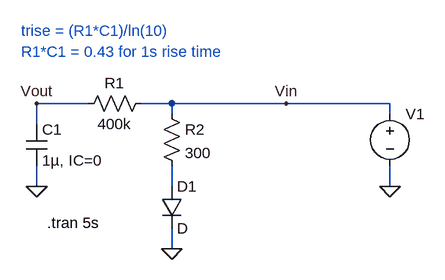
[diagram p0: schematic restart.asc]
restart.asc, the LTspice schematic file:
Version 4
SHEET 1 1756 680
WIRE 176 112 96 112
WIRE 304 112 256 112
WIRE 480 112 304 112
WIRE 640 112 480 112
WIRE 304 128 304 112
WIRE 640 128 640 112
WIRE 96 144 96 112
WIRE 96 240 96 208
WIRE 304 240 304 208
WIRE 640 240 640 208
WIRE 304 336 304 304
FLAG 96 240 0
FLAG 640 240 0
FLAG 96 112 Vout
FLAG 480 112 Vin
FLAG 304 336 0
SYMBOL cap 80 144 R0
SYMATTR InstName C1
SYMATTR Value 1µ, IC=0
SYMBOL res 272 96 R90
WINDOW 0 0 56 VBottom 2
WINDOW 3 32 56 VTop 2
SYMATTR InstName R1
SYMATTR Value 400k
SYMBOL voltage 640 112 R0
WINDOW 123 0 0 Left 0
WINDOW 39 0 0 Left 0
WINDOW 3 24 96 Invisible 2
SYMATTR InstName V1
SYMATTR Value PWL(0 0 19.99u 0 20u 5 39.99u 5 40u 0 99.99u 0 100u 5 199.99u 5 200u 0 299.99u 0 300u 5 2.99 5 3 0)
SYMBOL diode 288 240 R0
SYMATTR InstName D1
SYMBOL res 288 112 R0
SYMATTR InstName R2
SYMATTR Value 300
TEXT 112 296 Left 2 !.tran 5s
TEXT 72 32 Left 2 ;R1*C1 = 0.43 for 1s rise time
TEXT 72 0 Left 2 ;trise = (R1*C1)/ln(10)

The netlist it stands for:
* restart.asc
C1 Vout 0 1µ, IC=0
R1 Vin Vout 400k
V1 Vin 0 PWL(0 0 19.99u 0 20u 5 39.99u 5 40u 0 99.99u 0 100u 5 199.99u 5 200u 0 299.99u 0 300u 5 2.99 5 3 0)
D1 N001 0 D
R2 Vin N001 300
.model D D
.lib standard.dio
.tran 5s
* R1*C1 = 0.43 for 1s rise time
* trise = (R1*C1)/ln(10)
.backanno
.end

* Results of the author's LTspice run, read from the files saved beside the schematic
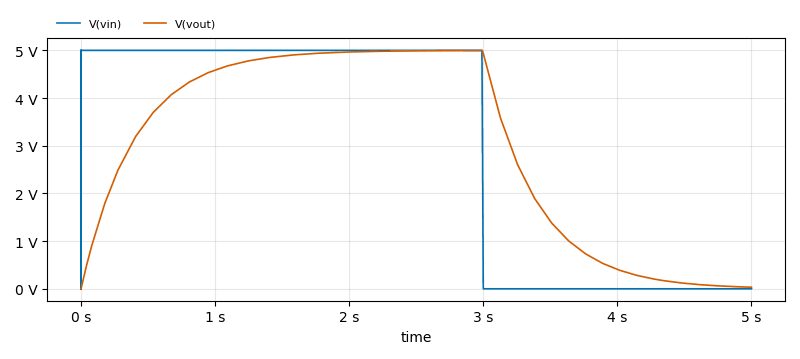
[diagram p1: Transient Analysis of restart.asc, plotted from the saved traces]
* Transient Analysis, 1 run:
*   V(vin): min 0 V, max 5 V, average 2.995 V, rms 3.869 V, last 0 V
*   V(vout): min 0 V, max 4.997 V, average 2.993 V, rms 3.605 V, last 33.25 mV